# EAGLE design psu (EAGLE 7.1.0)
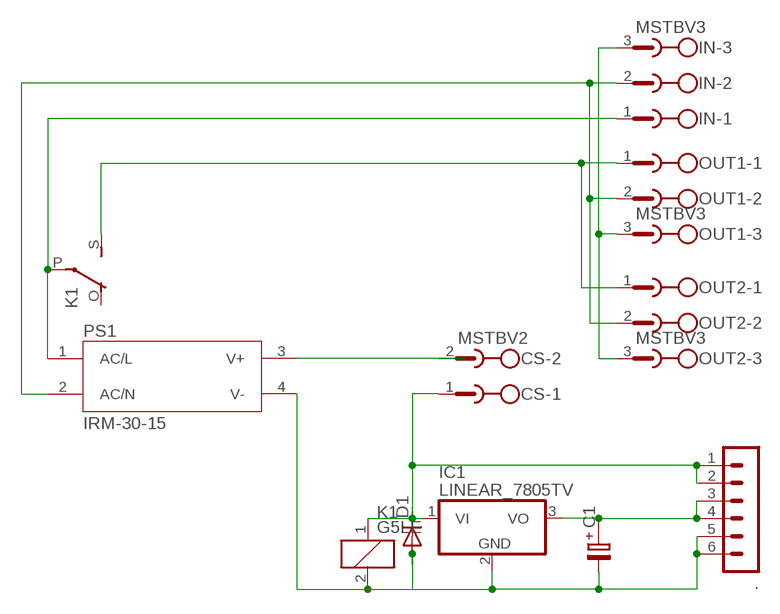
[diagram p0: schematic, sheet 1]

## Parts
.  MA06-1  [MA06-1]
C1  C-PR-2,0X5  [E2,0-5]
CS  MSTBV2  [MSTBV2]
D1  DIODE-D-2.5  [D-2.5]
IC1  LINEAR_7805TV  [LINEAR_TO220V]
IN  MSTBV3  [MSTBV3]
K1  G5LE  [G5LE]
OUT1  MSTBV3  [MSTBV3]
OUT2  MSTBV3  [MSTBV3]
PS1  IRM-30-15  [CONV_IRM-30-15]

## Nets
N$1: IN.1 K1.P(2:P) PS1.1(AC/L)
N$2: ..1 ..2 CS.1 D1.C IC1.1(VI) K1.1
N$3: K1.S(2:S) OUT1.1 OUT2.1
N$4: IN.2 OUT1.2 OUT2.2 PS1.2(AC/N)
N$5: IN.3 OUT1.3 OUT2.3
N$6: ..3 ..4 C1.+ IC1.3(VO)
N$7: CS.2 PS1.3(V+)
N$9: ..5 ..6 C1.- D1.A IC1.2(GND) K1.2 PS1.4(V-)
Unconnected: K1.O(2:O)

## Library data of the parts
. = con-lstb:MA06-1: PIN HEADER; OC_FARNELL: unknown; OC_NEWARK: unknown
C1 = cap-pan40:C-PR: POLARIZED ELECTROLYTIC/TANTALUM
CS = con-phoenix-508:MSTBV2: PHOENIX; MPN: MSTBV 2,5/2-GF-5.08; OC_FARNELL: 1792792; OC_NEWARK: 69R9845
D1 = diode:DIODE-: DIODE
IC1 = brakeflash-v2-rev_11:LINEAR_78*: Positive VOLTAGE REGULATOR Source: http://cache.national.com/ds/LM/LM78L05.pdf http://www.fairchildsemi.com/ds/LM/LM7805.pdf
IN OUT1 OUT2 = con-phoenix-508:MSTBV3: PHOENIX; MPN: MSTBV 2,5/3-GF-5.08; OC_FARNELL: 1792793; OC_NEWARK: 69R9846
K1 = relay:G5LE: RELAY 1 x switch, 10 A/120 V AC, 8 A/30 V DC, Omron; OC_FARNELL: unknown; OC_NEWARK: unknown
PS1 = IRM-30-15:IRM-30-15: AC-DC Single output Encapsulated power supply| PCB mount; Input 85-264VAC; Output 15VDC at 2A; Compact size Check prices <https://pricing.snapeda.com/parts/IRM-30-15/MEAN%20WELL/view-part?ref=eda>; AVAILABILITY: Warning; DESCRIPTION: Enclosed AC DC Converters 1 Output 15V 2A 85 ~ 264 VAC Input; MF: MEAN WELL; MP: IRM-30-15; PACKAGE: DIP-4 Mean Well; PRICE: None; PURCHASE-URL: https://pricing.snapeda.com/search/part/IRM-30-15/?ref=eda

## Board
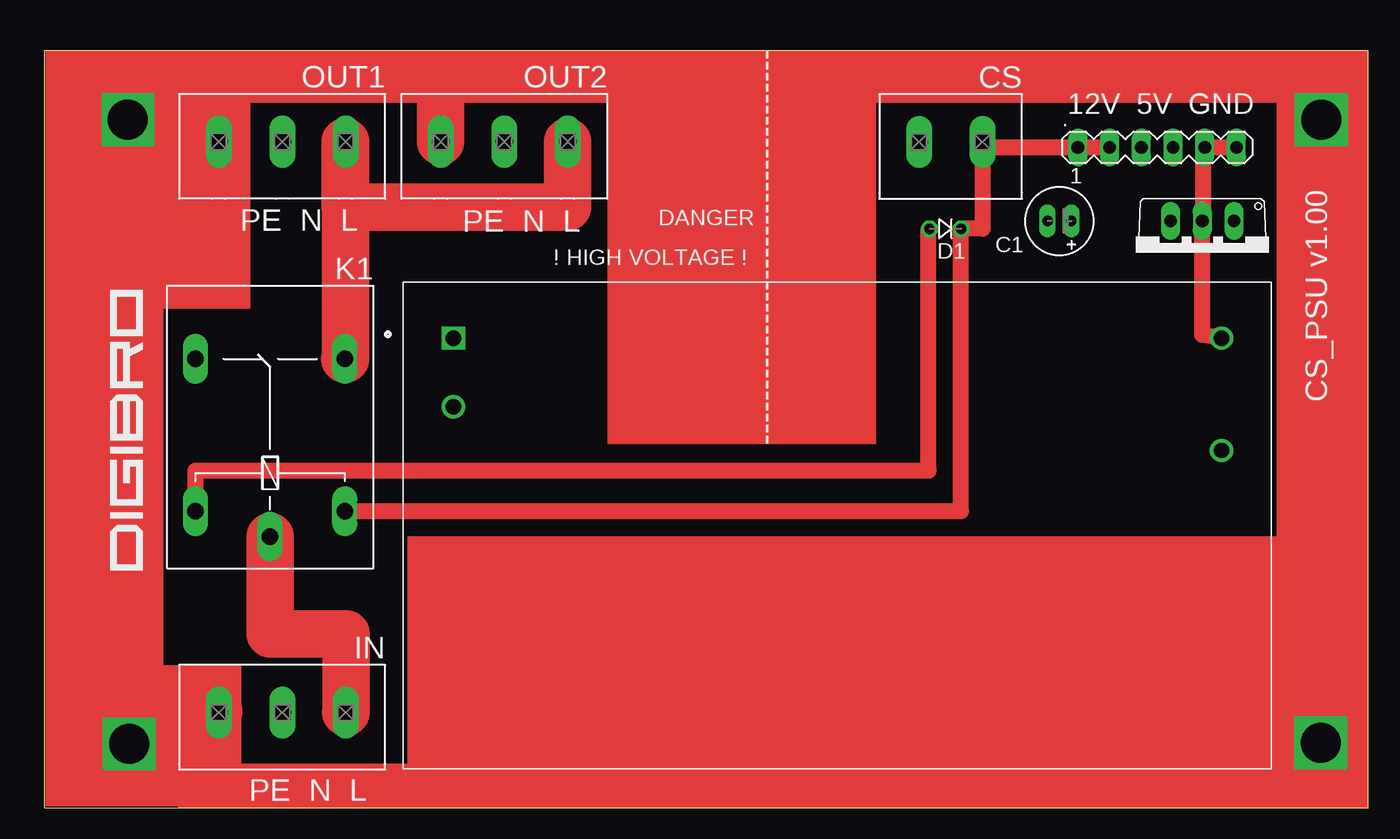
[diagram p1: board, top side]
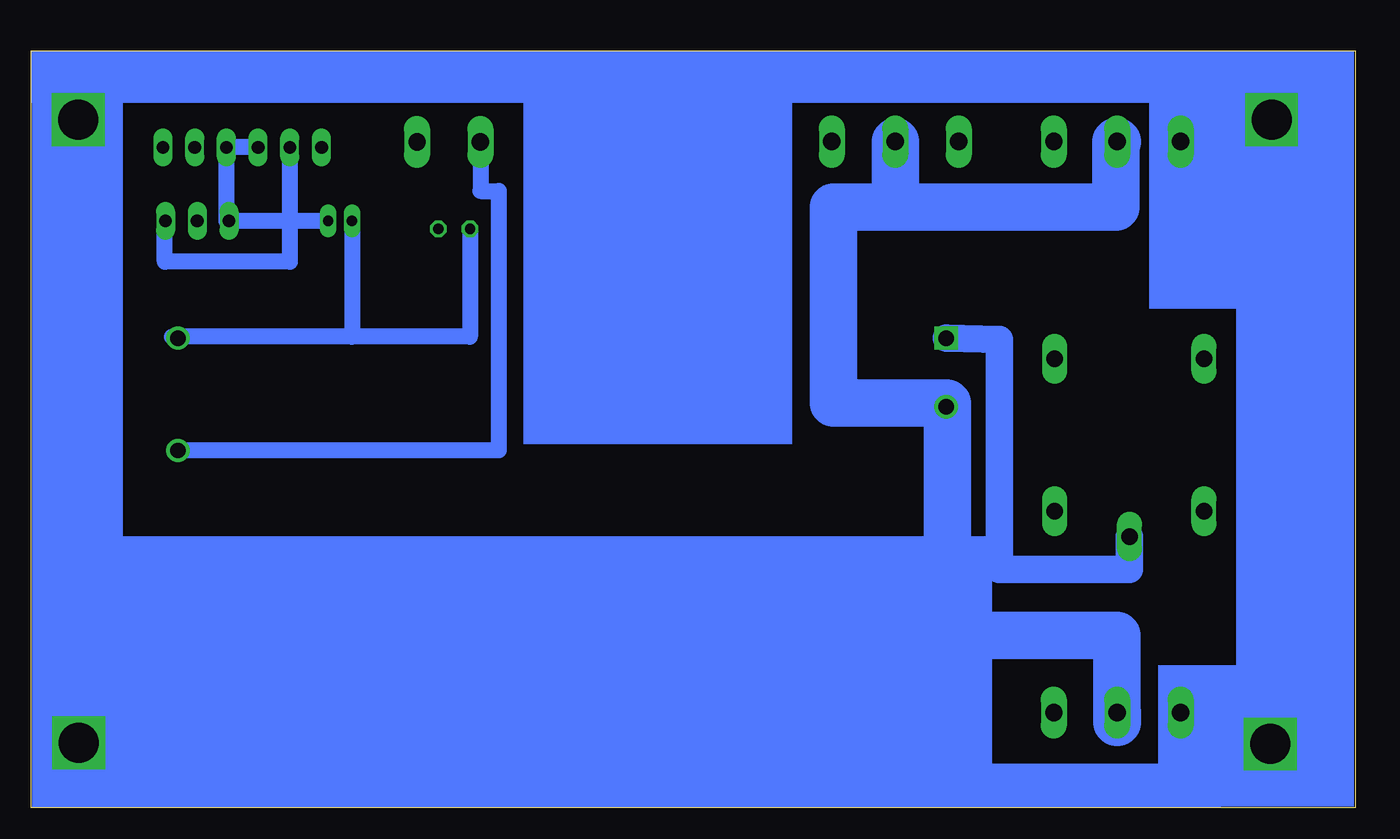
[diagram p2: board, bottom side, seen from below]

Size 106 x 60.63 mm. Coordinates in mm from the lower left corner, seen from the top.
Outline: 0,0 106,0 106,60.63 0,60.63 0,0
Copper layers (1*16): Top 0.035mm / dielectric 1.5mm / Bottom 0.035mm
Design rules "default": minimum track width 10mil, minimum drill 24mil, track to track 8mil, track to pad 8mil, pad to pad 8mil, via to via 8mil, smd to smd 8mil, copper to edge 40mil, drill to drill 8mil, minimum pad ring 10mil, minimum via ring 8mil, stop-mask expansion 4mil, vias tented up to drill 0mil, thermal gap 10mil

### Footprints (pad centres in the part's own frame; a part is rotated, then mirrored left to right if it is on the bottom)
MA06-1 = drill 1.016 long: 1 -6.35,0; 2 -3.81,0; 3 -1.27,0; 4 1.27,0; 5 3.81,0; 6 6.35,0
E2,0-5 = drill 0.813 long: + -0.953,0; - 0.953,0
MSTBV2 = drill 1.397 long: 1 -2.54,0; 2 2.54,0
D-2.5 = drill 0.813 octagon: A 1.27,0; C -1.27,0
LINEAR_TO220V = drill 1.016 long: 1 -2.54,-2.54; 2 0,-2.54; 3 2.54,-2.54
MSTBV3 = drill 1.397 long: 1 -5.08,0; 2 0,0; 3 5.08,0
G5LE = drill 1.321 long: 1 -7.493,-5.969; 2 -7.493,5.969; O 4.699,5.969; P -9.525,0; S 4.699,-5.969
CONV_IRM-30-15 = drill 1.24 pad 1.86 square: 1 -30.75,15 | drill 1.24 pad 1.86: 2 -30.75,9.5; 3 30.75,6; 4 30.75,15

### Placement (x,y rotation side)
.  89.1,52.88 0 top
C1  81.28,46.99 180 top
CS  72.57,53.31 180 top
D1  72.14,46.35 180 top
IC1  92.71,44.45 180 top
IN  19.05,7.62 180 top
K1  18.08,31.24 90 top
OUT1  19.05,53.34 180 top
OUT2  36.83,53.34 180 top
PS1  63.5,22.61 0 top

### Tracks (layer width: path | path; a pad name or v marks a point on that pad's centre or on a via)
N$1
  Top 3.81: IN.1 24.18,7.62 24.18,13.92 18.09,13.92 K1.P
  Bottom 2.184: PS1.1 28.5,37.5 28.5,19.1 18.09,19.1 K1.P
N$2
  Top 1.27: K1.1 73.41,23.75 D1.C 75.11,46.35 CS.1 75.11,52.88 ..1 ..2
  Bottom 1.27: ..2 85.29,43.71 95.3,43.71 95.3,46.99 IC1.1
N$3
  Top 3.81: K1.S 24.13,35.94 OUT1.1 24.11,53.34 24.11,48.08 41.91,48.08 OUT2.1
N$4
  Bottom 3.81: OUT1.2 19.18,53.34 19.18,48.08 36.83,48.08 | 36.83,48.08 OUT2.2 | 36.83,48.08 41.76,48.08 41.76,32.41 32.75,32.41 PS1.2 32.64,32.36 32.64,13.82 19.1,13.82 19.1,6.86 19.05,6.86 IN.2
N$5
  Top 3.81: OUT2.3 31.75,58.34 31.73,58.37 13.97,58.37 OUT1.3 14.07,53.34 14.07,58.22 2.77,58.22 2.77,7.7 13.46,7.7 13.46,7.8 13.97,7.8 IN.3
N$6
  Bottom 1.27: C1.+ IC1.3 90.37,46.99 ..4 ..3
N$7
  Bottom 1.27: CS.2 70.03,49.38 68.58,49.38 68.58,28.61 PS1.3
N$8  (via drill 3.2)
  other vias: 6.7,55.1
N$9
  Top 1.27: K1.2 12.12,27 70.79,27 70.79,46.35 D1.A | PS1.4 92.71,37.86 IC1.2 92.79,46.99 92.79,53.29 ..5 ..6
  Bottom 1.27: D1.A 70.87,37.72 80.33,37.72 | 80.33,37.72 94.25,37.72 | 94.25,37.72 94.74,37.72 | PS1.4 94.25,37.72 | C1.- 80.33,37.72
N$10  (via drill 3.2)
  other vias: 6.8,5.1
N$11  (via drill 3.2)
  other vias: 102.19,5.2
N$12  (via drill 3.2)
  other vias: 102.24,55.1
(copper drawn outside any net)
  shapes: Bottom area x8, Top area x9

### Text on the board
tPlace: ------------------------------------ | 12V 5V GND | CS_PSU v1.00 | PE N L | PE N L | DANGER | ! HIGH VOLTAGE ! | PE N L